# EAGLE design mkstepper17 (EAGLE 9.0.0)
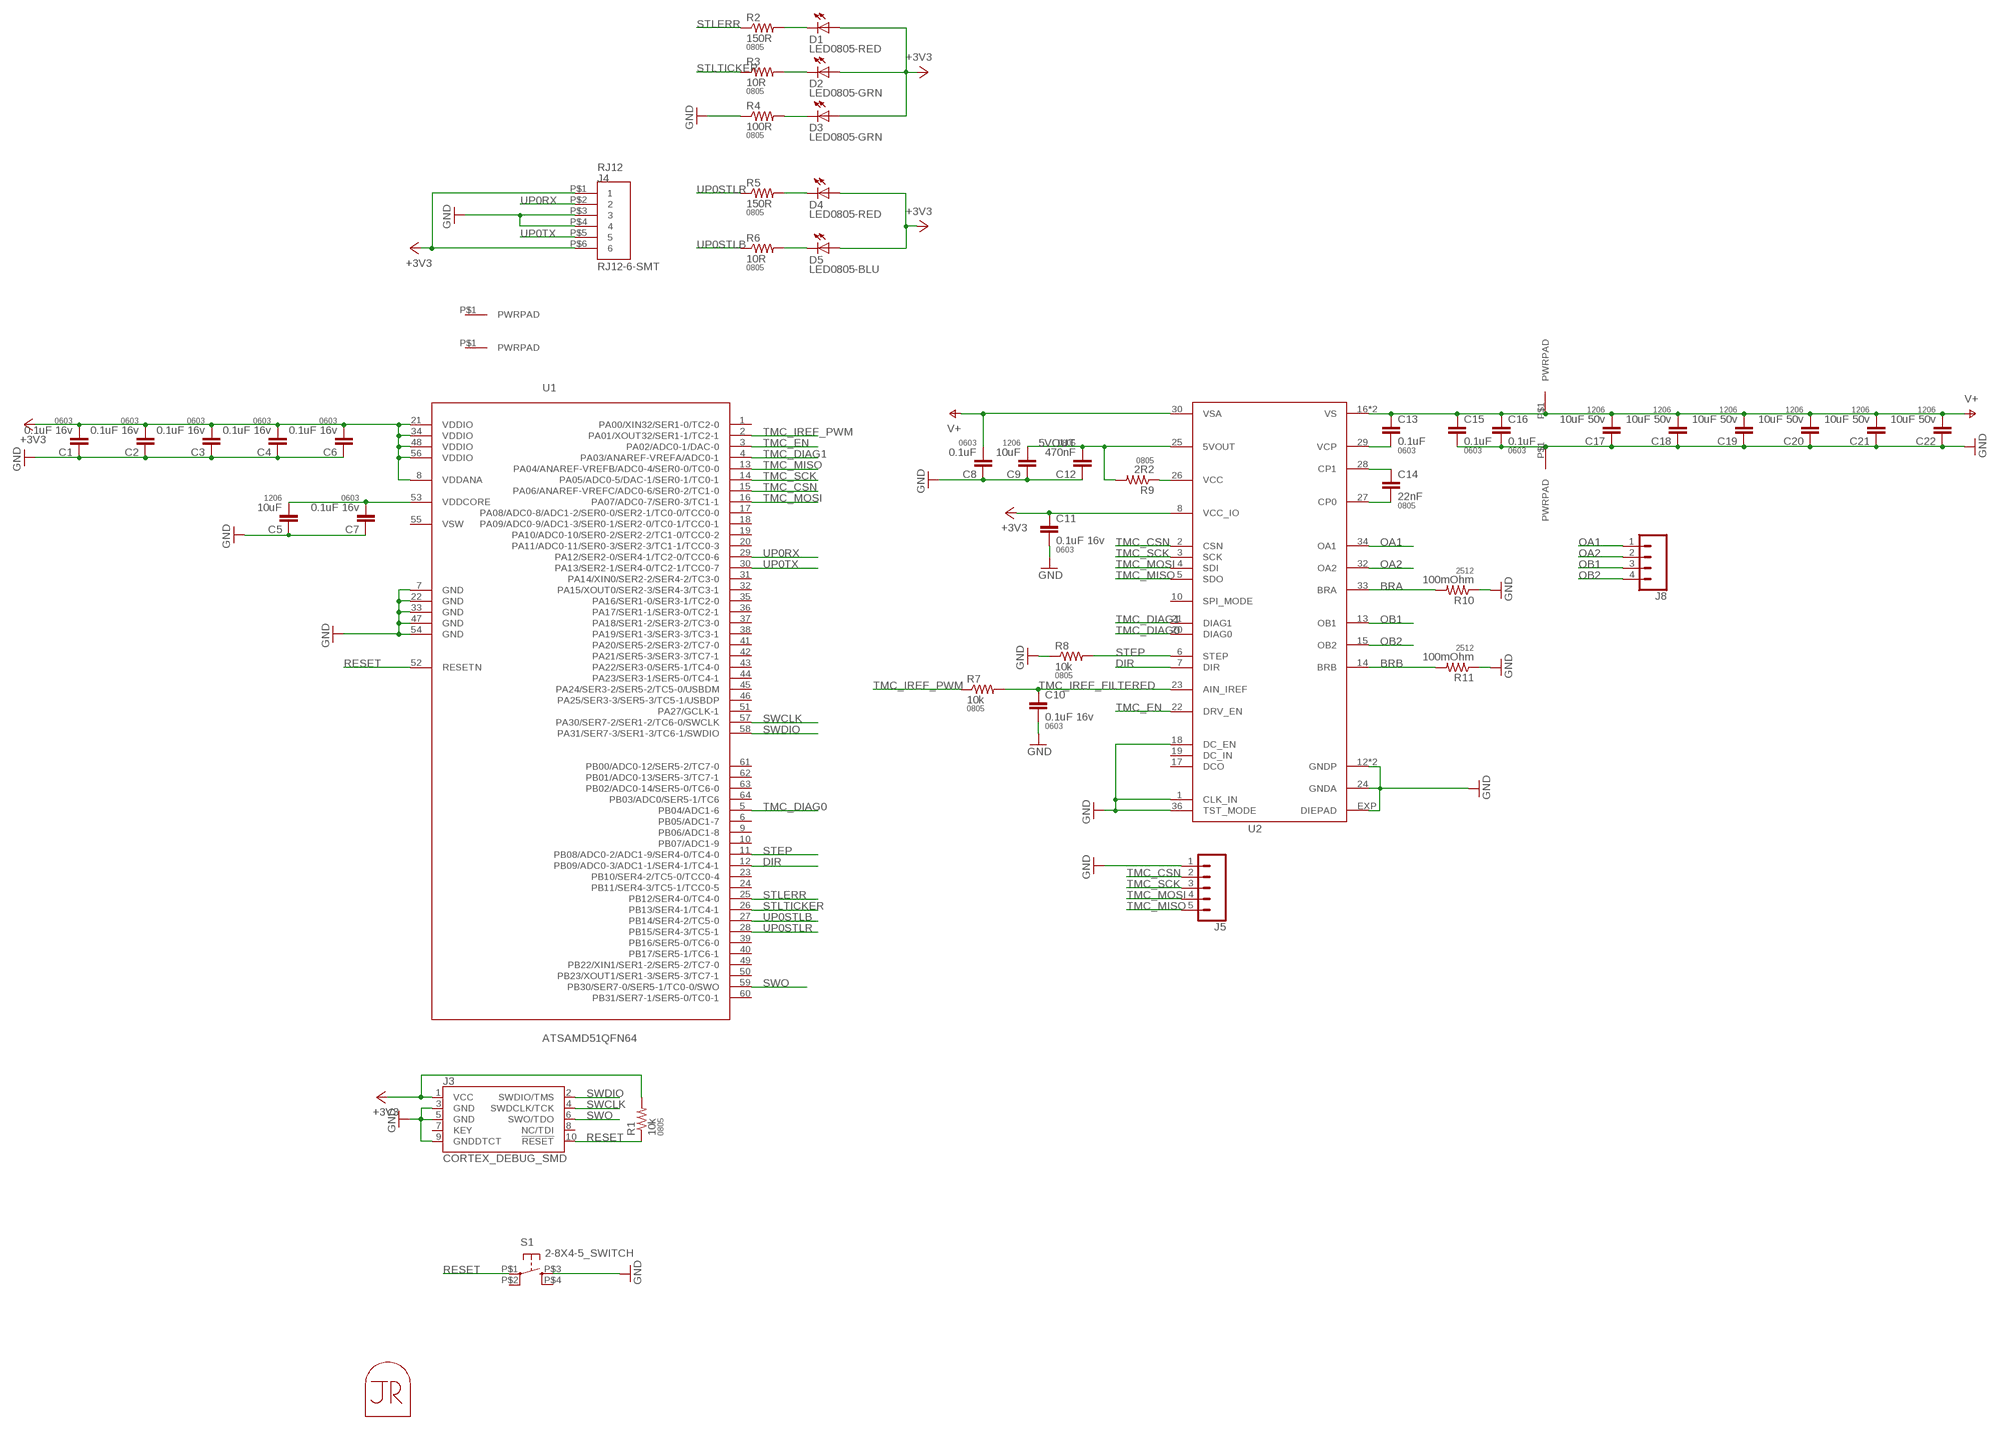
[diagram p0: schematic, sheet 1]

## Parts
C1  0.1uF 16v  CAP0603-CAP  [0603-CAP]
C2  0.1uF 16v  CAP0603-CAP  [0603-CAP]
C3  0.1uF 16v  CAP0603-CAP  [0603-CAP]
C4  0.1uF 16v  CAP0603-CAP  [0603-CAP]
C5  10uF  CAP1206  [1206]
C6  0.1uF 16v  CAP0603-CAP  [0603-CAP]
C7  0.1uF 16v  CAP0603-CAP  [0603-CAP]
C8  0.1uF  CAP0603-CAP  [0603-CAP]
C9  10uF  CAP1206  [1206]
C10  0.1uF 16v  CAP0603-CAP  [0603-CAP]
C11  0.1uF 16v  CAP0603-CAP  [0603-CAP]
C12  470nF  CAP0805  [0805]
C13  0.1uF  CAP0603-CAP  [0603-CAP]
C14  22nF  CAP0805  [0805]
C15  0.1uF  CAP0603-CAP  [0603-CAP]
C16  0.1uF  CAP0603-CAP  [0603-CAP]
C17  10uF 50v  CAP1206  [1206]
C18  10uF 50v  CAP1206  [1206]
C19  10uF 50v  CAP1206  [1206]
C20  10uF 50v  CAP1206  [1206]
C21  10uF 50v  CAP1206  [1206]
C22  10uF 50v  CAP1206  [1206]
D1  LED0805-RED  LED0805  [LED0805]
D2  LED0805-GRN  LED0805  [LED0805]
D3  LED0805-GRN  LED0805  [LED0805]
D4  LED0805-RED  LED0805  [LED0805]
D5  LED0805-BLU  LED0805  [LED0805]
J1  PWRPADM3  [PWRPAD_3-25MM]
J2  PWRPADM3  [PWRPAD_3-25MM]
J3  CORTEX_DEBUG_SMD  [SAMTECH_FTSH-105-01]
J4  RJ12-6-SMT  [RJ12-6-SMT]
J5  CONN_05NO_SILK  [1X05_NO_SILK]
J6  PWRPAD  [PWRPAD_M3-PEM-MOUNT]
J7  PWRPAD  [PWRPAD_M3-PEM-MOUNT]
J8  CONN_04LONGPADS  [1X04_LONGPADS]
MP1  JRTOMBSTONE  [JRTOMBSTONE]
R1  10k  RESISTOR0805-RES  [0805]
R2  150R  RESISTOR0805-RES  [0805]
R3  10R  RESISTOR0805-RES  [0805]
R4  100R  RESISTOR0805-RES  [0805]
R5  150R  RESISTOR0805-RES  [0805]
R6  10R  RESISTOR0805-RES  [0805]
R7  10k  RESISTOR0805-RES  [0805]
R8  10k  RESISTOR0805-RES  [0805]
R9  2R2  RESISTOR0805-RES  [0805]
R10  100mOhm  RESISTOR2512  [R2512]
R11  100mOhm  RESISTOR2512  [R2512]
S1  2-8X4-5_SWITCH  [TACT-SWITCH-KMR6]
U1  ATSAMD51QFN64  [QFN-64-9X9MM]
U2  TMC2130  [QFN36-5X6]

## Nets
5VOUT: C9.2 C12.2 R9.2 U2.25(5VOUT)
+3V3: C1.2 C2.2 C3.2 C4.2 C6.2 C11.1 D1.1(A) D2.1(A) D3.1(A) D4.1(A) D5.1(A) J3.1(VCC) J4.P$1 J4.P$6 R1.2 U1.8(VDDANA) U1.21(VDDIO) U1.34(VDDIO) U1.48(VDDIO) U1.56(VDDIO) U2.8(VCC_IO)
BRA: R10.2 U2.33(BRA)
BRB: R11.2 U2.14(BRB)
DIR: U1.12(PB09/ADC0-3/ADC1-1/SER4-1/TC4-1) U2.7(DIR)
GND: C1.1 C2.1 C3.1 C4.1 C5.1 C6.1 C7.1 C8.1 C9.1 C10.2 C11.2 C12.1 C15.2 C16.2 C17.1 C18.1 C19.1 C20.1 C21.1 C22.1 J3.3(GND) J3.5(GND) J3.9(GNDDTCT) J4.P$3 J4.P$4 J5.1 J7.P$1(PWRPAD) R4.1 R8.1 R10.1 R11.1 S1.P$3(S) U1.7(GND) U1.22(GND) U1.33(GND) U1.47(GND) U1.54(GND) U2.1(CLK_IN) U2.12(GNDP) U2.18(DC_EN) U2.24(GNDA) U2.35(GNDP) U2.36(TST_MODE) U2.EXP(DIEPAD)
N$1: D3.2(C) R4.2
N$5: D2.2(C) R3.2
N$6: D1.2(C) R2.2
N$7: C5.2 C7.2 U1.53(VDDCORE)
N$10: D4.2(C) R5.2
N$11: D5.2(C) R6.2
N$12: C14.2 U2.27(CP0)
N$13: R9.1 U2.26(VCC)
N$14: C14.1 U2.28(CP1)
N$15: C13.2 U2.29(VCP)
OA1: J8.1 U2.34(OA1)
OA2: J8.2 U2.32(OA2)
OB1: J8.3 U2.13(OB1)
OB2: J8.4 U2.15(OB2)
RESET: J3.10(!RESET) R1.1 S1.P$1(P) U1.52(RESETN)
STEP: R8.2 U1.11(PB08/ADC0-2/ADC1-9/SER4-0/TC4-0) U2.6(STEP)
STLERR: R2.1 U1.25(PB12/SER4-0/TC4-0)
STLTICKER: R3.1 U1.26(PB13/SER4-1/TC4-1)
SWCLK: J3.4(SWDCLK/TCK) U1.57(PA30/SER7-2/SER1-2/TC6-0/SWCLK)
SWDIO: J3.2(SWDIO/TMS) U1.58(PA31/SER7-3/SER1-3/TC6-1/SWDIO)
SWO: J3.6(SWO/TDO) U1.59(PB30/SER7-0/SER5-1/TC0-0/SWO)
TMC_CSN: J5.2 U1.15(PA06/ANAREF-VREFC/ADC0-6/SER0-2/TC1-0) U2.2(CSN)
TMC_DIAG0: U1.5(PB04/ADC1-6) U2.20(DIAG0)
TMC_DIAG1: U1.4(PA03/ANAREF-VREFA/ADC0-1) U2.21(DIAG1)
TMC_EN: U1.3(PA02/ADC0-1/DAC-0) U2.22(DRV_EN)
TMC_IREF_FILTERED: C10.1 R7.2 U2.23(AIN_IREF)
TMC_IREF_PWM: R7.1 U1.2(PA01/XOUT32/SER1-1/TC2-1)
TMC_MISO: J5.5 U1.13(PA04/ANAREF-VREFB/ADC0-4/SER0-0/TC0-0) U2.5(SDO)
TMC_MOSI: J5.4 U1.16(PA07/ADC0-7/SER0-3/TC1-1) U2.4(SDI)
TMC_SCK: J5.3 U1.14(PA05/ADC0-5/DAC-1/SER0-1/TC0-1) U2.3(SCK)
UP0RX: J4.P$2 U1.29(PA12/SER2-0/SER4-1/TC2-0/TCC0-6)
UP0STLB: R6.1 U1.27(PB14/SER4-2/TC5-0)
UP0STLR: R5.1 U1.28(PB15/SER4-3/TC5-1)
UP0TX: J4.P$5 U1.30(PA13/SER2-1/SER4-0/TC2-1/TCC0-7)
V+: C8.2 C13.1 C15.1 C16.1 C17.2 C18.2 C19.2 C20.2 C21.2 C22.2 J6.P$1(PWRPAD) U2.16(VS) U2.30(VSA) U2.31(VS)
Unconnected: J1.P$1(PWRPAD) J2.P$1(PWRPAD) J3.7(KEY) J3.8(NC/TDI) S1.P$2(P1) S1.P$4(S1) U1.1(PA00/XIN32/SER1-0/TC2-0) U1.6(PB05/ADC1-7) U1.9(PB06/ADC1-8) U1.10(PB07/ADC1-9) U1.17(PA08/ADC0-8/ADC1-2/SER0-0/SER2-1/TC0-0/TCC0-0) U1.18(PA09/ADC0-9/ADC1-3/SER0-1/SER2-0/TC0-1/TCC0-1) U1.19(PA10/ADC0-10/SER0-2/SER2-2/TC1-0/TCC0-2) U1.20(PA11/ADC0-11/SER0-3/SER2-3/TC1-1/TCC0-3) U1.23(PB10/SER4-2/TC5-0/TCC0-4) U1.24(PB11/SER4-3/TC5-1/TCC0-5) U1.31(PA14/XIN0/SER2-2/SER4-2/TC3-0) U1.32(PA15/XOUT0/SER2-3/SER4-3/TC3-1) U1.35(PA16/SER1-0/SER3-1/TC2-0) U1.36(PA17/SER1-1/SER3-0/TC2-1) U1.37(PA18/SER1-2/SER3-2/TC3-0) U1.38(PA19/SER1-3/SER3-3/TC3-1) U1.39(PB16/SER5-0/TC6-0) U1.40(PB17/SER5-1/TC6-1) U1.41(PA20/SER5-2/SER3-2/TC7-0) U1.42(PA21/SER5-3/SER3-3/TC7-1) U1.43(PA22/SER3-0/SER5-1/TC4-0) U1.44(PA23/SER3-1/SER5-0/TC4-1) U1.45(PA24/SER3-2/SER5-2/TC5-0/USBDM) U1.46(PA25/SER3-3/SER5-3/TC5-1/USBDP) U1.49(PB22/XIN1/SER1-2/SER5-2/TC7-0) U1.50(PB23/XOUT1/SER1-3/SER5-3/TC7-1) U1.51(PA27/GCLK-1) U1.55(VSW) U1.60(PB31/SER7-1/SER5-0/TC0-1) U1.61(PB00/ADC0-12/SER5-2/TC7-0) U1.62(PB01/ADC0-13/SER5-3/TC7-1) U1.63(PB02/ADC0-14/SER5-0/TC6-0) U1.64(PB03/ADC0/SER5-1/TC6) U2.10(SPI_MODE) U2.17(DCO) U2.19(DC_IN)

## Library data of the parts
C1-C4 C6-C8 C10 C11 C13 C15 C16 = borkedlabs-passives:CAP: Capacitor Standard 0603 ceramic capacitor, and 0.1" leaded capacitor.; PACKAGE: 0603
C5 C9 C17-C22 = borkedlabs-passives:CAP: Capacitor Standard 0603 ceramic capacitor, and 0.1" leaded capacitor.; PACKAGE: 1206
C12 C14 = borkedlabs-passives:CAP: Capacitor Standard 0603 ceramic capacitor, and 0.1" leaded capacitor.; PACKAGE: 0805
D1-D5 = lights:LED: LED
J1 J2 J6 J7 = power:PWRPAD
J3 = SparkFun-Connectors:CORTEX_DEBUG: Cortex Debug Connector - 10 pin Supports JTAG debug, Serial Wire debug, and Serial Wire Viewer. PTH and SMD connector options available. General Connector Information <http://infocenter.arm.com/help/topic/com.arm.doc.faqs/attached/13634/cortex_debug_connectors.pdf> Products: PTH Connector <http://www.digikey.com/product-detail/en/cnc-tech/3220-10-0100-00/1175-1627-ND/3883661> -via Digi-Key SparkFun PSoc <https://www.sparkfun.com/products/13229> SparkFun T <https://www.sparkfun.com/products/13810>
J4 = connector:RJ12-6-SMT
J5 = SparkFun-Connectors:CONN_05: Multi connection point. Often used as Generic Header-pin footprint for 0.1 inch spaced/style header connections On any of the 0.1 inch spaced packages, you can populate with these: Break Away Headers - Straight <https://www.sparkfun.com/products/116> (PRT-00116) Break Away Male Headers - Right Angle <https://www.sparkfun.com/products/553> (PRT-00553) Female Headers <https://www.sparkfun.com/products/115> (PRT-00115) Break Away Headers - Machine Pin <https://www.sparkfun.com/products/117> (PRT-00117) Break Away Female Headers - Swiss Machine Pin <https://www.sparkfun.com/products/743> (PRT-00743) For SCREWTERMINALS and SPRING TERMINALS visit here: Screw Terimnals on SparkFun.com <https://www.sparkfun.com/search/results?term=Screw+Terminals> (5mm/3.5mm/2.54mm spacing) This device is also useful as a general connection point to wire up your design to another part of your project. Our various solder wires solder well into these plated through hole pads. Hook-Up Wire - Assortment (Stranded, 22 AWG) <https://www.sparkfun.com/products/11375> (PRT-11375) Hook-Up Wire - Assortment (Solid Core, 22 AWG) <https://www.sparkfun.com/products/11367> (PRT-11367) View the entire wire category on our website here <https://www.sparkfun.com/categories/141> Special notes: Molex polarized connector foot print use with SKU : PRT-08231 with associated crimp pins and housings. 1MM SMD Version SKU: PRT-10208
J8 = SparkFun-Connectors:CONN_04: Multi connection point. Often used as Generic Header-pin footprint for 0.1 inch spaced/style header connections On any of the 0.1 inch spaced packages, you can populate with these: Break Away Headers - Straight <https://www.sparkfun.com/products/116> (PRT-00116) Break Away Male Headers - Right Angle <https://www.sparkfun.com/products/553> (PRT-00553) Female Headers <https://www.sparkfun.com/products/115> (PRT-00115) Break Away Headers - Machine Pin <https://www.sparkfun.com/products/117> (PRT-00117) Break Away Female Headers - Swiss Machine Pin <https://www.sparkfun.com/products/743> (PRT-00743) For SCREWTERMINALS and SPRING TERMINALS visit here: Screw Terimnals on SparkFun.com <https://www.sparkfun.com/search/results?term=Screw+Terminals> (5mm/3.5mm/2.54mm spacing) This device is also useful as a general connection point to wire up your design to another part of your project. Our various solder wires solder well into these plated through hole pads. Hook-Up Wire - Assortment (Stranded, 22 AWG) <https://www.sparkfun.com/products/11375> (PRT-11375) Hook-Up Wire - Assortment (Solid Core, 22 AWG) <https://www.sparkfun.com/products/11367> (PRT-11367) View the entire wire category on our website here <https://www.sparkfun.com/categories/141> Special notes: Molex polarized connector foot print use with SKU : PRT-08231 with associated crimp pins and housings. 1MM SMD Version SKU: PRT-10208; PROD_ID: CONN-09696
MP1 = connector:JRTOMBSTONE
R1-R9 = borkedlabs-passives:RESISTOR: Resistor Basic schematic elements and footprints for 0603, 1206, and PTH resistors.; PACKAGE: 0805
R10 R11 = borkedlabs-passives:RESISTOR: Resistor Basic schematic elements and footprints for 0603, 1206, and PTH resistors.; PACKAGE: 2512
S1 = fab:2-8X4-5_SWITCH
U1 = atsam:ATSAMD51
U2 = power:TMC2130

## Board
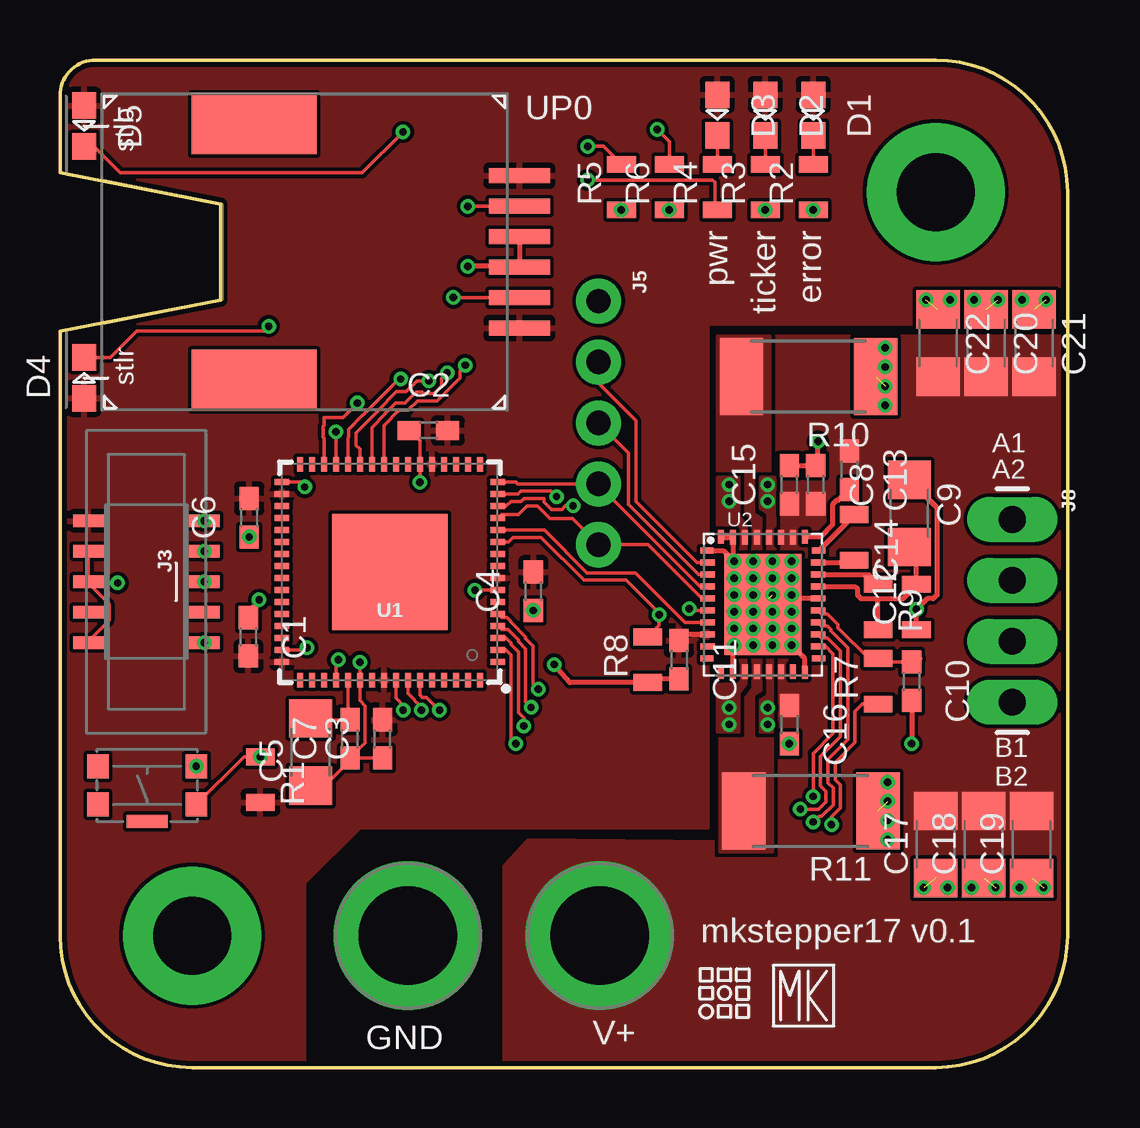
[diagram p1: board, top side]
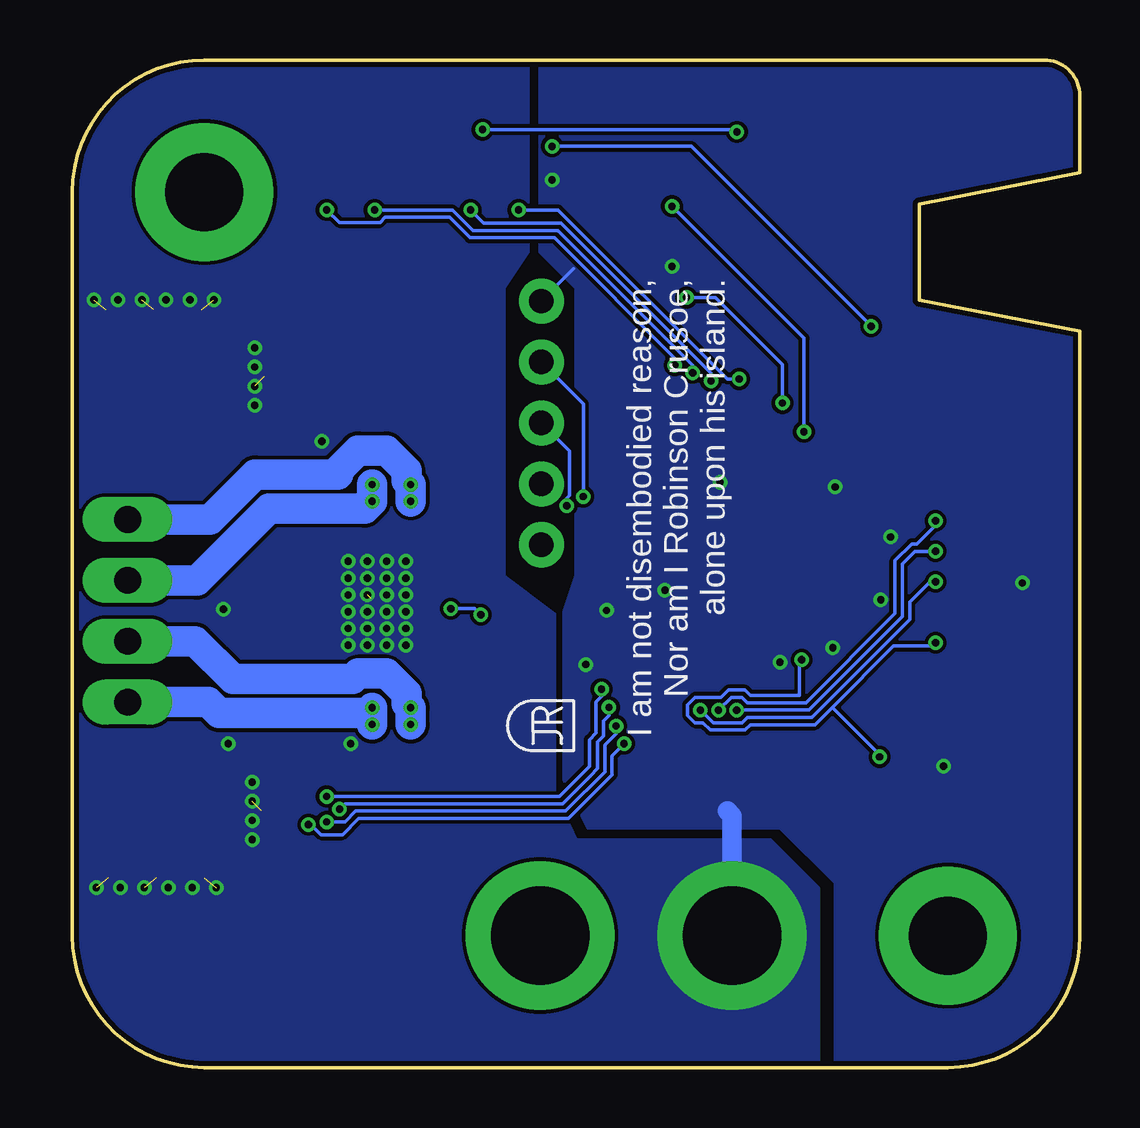
[diagram p2: board, bottom side, seen from below]

Size 42 x 42 mm. Coordinates in mm from the lower left corner, seen from the top.
Outline: 5.5,0 36.5,0 arc90 42,5.5 42,36.5 arc90 36.5,42 1.5,42 arc90 0,40.5 0,37.3 6.7,36 6.7,32 0,30.7 0,5.5 arc90 5.5,0
Copper layers (1*16): Top 0.035mm / dielectric 1.5mm / Bottom 0.035mm
Design rules "default *": minimum track width 6mil, minimum drill 0.3mm, track to track 6mil, track to pad 6mil, pad to pad 6mil, via to via 6mil, smd to smd 6mil, copper to edge 8mil, drill to drill 8mil, minimum pad ring 6mil, minimum via ring 6mil, stop-mask expansion 4mil, vias tented up to drill 27mil, thermal gap 9mil

### Footprints (pad centres in the part's own frame; a part is rotated, then mirrored left to right if it is on the bottom)
0603-CAP = smd 0.96 x 0.8: 1 -0.8,0; 2 0.8,0
1206 = smd 1.6 x 1.8: 1 -1.4,0; 2 1.4,0
0805 = smd 0.7 x 1.2: 1 -0.95,0; 2 0.95,0
LED0805 = smd 1.1 x 1: 1 -0.85,0; 2 0.85,0
PWRPAD_3-25MM = drill 3.25 pad 5.75: P$1 0,0
SAMTECH_FTSH-105-01 = smd 0.508 x 1.27: 1 -2.54,-2.413; 2 -2.54,2.413; 3 -1.27,-2.413; 4 -1.27,2.413; 5 0,-2.413; 6 0,2.413; 7 1.27,-2.413; 8 1.27,2.413; 9 2.54,-2.413; 10 2.54,2.413
RJ12-6-SMT = smd 0.635 x 2.54: P$1 -3.175,17.399; P$2 -1.905,17.399; P$3 -0.635,17.399; P$4 0.635,17.399; P$5 1.905,17.399; P$6 3.175,17.399 | smd 2.54 x 5.207: P$7 -5.334,6.35; P$8 5.334,6.35
1X05_NO_SILK = drill 1.016 pad 1.88: 1 0,0; 2 2.54,0; 3 5.08,0; 4 7.62,0; 5 10.16,0
PWRPAD_M3-PEM-MOUNT = drill 4.1 pad 6.2: P$1 0,0
1X04_LONGPADS = drill 1.118 pad 1.88 long: 1 0,0; 2 2.54,0; 3 5.08,0; 4 7.62,0
R2512 = smd 1.8 x 3.2: 1 -2.8,0; 2 2.8,0
TACT-SWITCH-KMR6 = smd 0.9 x 1: P$1 -2.05,0.8; P$2 2.05,0.8; P$3 -2.05,-0.8; P$4 2.05,-0.8 | smd 1.7 x 0.55: P$5 0,1.5
QFN-64-9X9MM = smd 0.6 x 0.25: 1 -4.5,3.75; 2 -4.5,3.25; 3 -4.5,2.75; 4 -4.5,2.25; 5 -4.5,1.75; 6 -4.5,1.25; 7 -4.5,0.75; 8 -4.5,0.25; 9 -4.5,-0.25; 10 -4.5,-0.75; 11 -4.5,-1.25; 12 -4.5,-1.75; 13 -4.5,-2.25; 14 -4.5,-2.75; 15 -4.5,-3.25; 16 -4.5,-3.75; 33 4.5,-3.75; 34 4.5,-3.25; 35 4.5,-2.75; 36 4.5,-2.25; 37 4.5,-1.75; 38 4.5,-1.25; 39 4.5,-0.75; 40 4.5,-0.25; 41 4.5,0.25; 42 4.5,0.75; 43 4.5,1.25; 44 4.5,1.75; 45 4.5,2.25; 46 4.5,2.75; 47 4.5,3.25; 48 4.5,3.75 | smd 0.25 x 0.6: 17 -3.75,-4.5; 18 -3.25,-4.5; 19 -2.75,-4.5; 20 -2.25,-4.5; 21 -1.75,-4.5; 22 -1.25,-4.5; 23 -0.75,-4.5; 24 -0.25,-4.5; 25 0.25,-4.5; 26 0.75,-4.5; 27 1.25,-4.5; 28 1.75,-4.5; 29 2.25,-4.5; 30 2.75,-4.5; 31 3.25,-4.5; 32 3.75,-4.5; 49 3.75,4.5; 50 3.25,4.5; 51 2.75,4.5; 52 2.25,4.5; 53 1.75,4.5; 54 1.25,4.5; 55 0.75,4.5; 56 0.25,4.5; 57 -0.25,4.5; 58 -0.75,4.5; 59 -1.25,4.5; 60 -1.75,4.5; 61 -2.25,4.5; 62 -2.75,4.5; 63 -3.25,4.5; 64 -3.75,4.5 | smd 4.826 x 4.826: P$1 0,0
QFN36-5X6 = smd 0.55 x 0.25: 1 -2.325,1.75; 10 -2.325,-2.75; 19 2.325,-2.75; 28 2.325,1.75 | smd 0.6 x 0.25: 2 -2.3,1.25; 3 -2.3,0.75; 4 -2.3,0.25; 5 -2.3,-0.25; 6 -2.3,-0.75; 7 -2.3,-1.25; 8 -2.3,-1.75; 9 -2.3,-2.25; 20 2.3,-2.25; 21 2.3,-1.75; 22 2.3,-1.25; 23 2.3,-0.75; 24 2.3,-0.25; 25 2.3,0.25; 26 2.3,0.75; 27 2.3,1.25 | smd 0.25 x 0.55: 11 -1.75,-3.325; 18 1.75,-3.325; 29 1.75,2.325; 36 -1.75,2.325 | smd 0.25 x 0.6: 12 -1.25,-3.3; 13 -0.75,-3.3; 14 -0.25,-3.3; 15 0.25,-3.3; 16 0.75,-3.3; 17 1.25,-3.3; 30 1.25,2.3; 31 0.75,2.3; 32 0.25,2.3; 33 -0.25,2.3; 34 -0.75,2.3; 35 -1.25,2.3 | smd 3.2 x 4.2: EXP 0,-0.5

### Placement (x,y rotation side)
C1  7.85,17.95 270 top
C2  15.36,26.55 0 top
C3  13.45,13.7 90 top
C4  19.73,19.85 90 top
C5  10.45,13.15 90 top
C6  7.89,22.92 90 top
C7  12.1,13.7 90 top
C8  31.5,24.3 270 top
C9  35.4,23.1 270 top
C10  35.5,16.1 270 top
C11  25.8,17 270 top
C12  35.7,19.2 90 top
C13  32.9,24.9 270 top
C14  33.1,22.1 270 top
C15  30.4,24.3 90 top
C16  30.4,14.3 270 top
C17  36.5,9.3 90 top
C18  38.5,9.3 90 top
C19  40.5,9.3 90 top
C20  38.6,30.2 270 top
C21  40.6,30.2 270 top
C22  36.6,30.2 270 top
D1  31.4,39.7 270 top
D2  29.4,39.7 270 top
D3  27.4,39.7 270 top
D4  1,28.75 90 top
D5  1,39.25 270 top
J1  36.5,36.5 0 top
J2  5.5,5.5 0 top
J3  3.6,20.25 270 top
J4  1.75,34 270 top
J5  22.45,31.95 270 top
J6  22.5,5.5 0 top
J7  14.5,5.5 0 top
J8  39.7,22.85 270 top
MP1  22.1,14.3 90 bottom
R1  8.35,12 270 top
R2  31.4,36.7 90 top
R3  29.4,36.7 90 top
R4  27.4,36.7 90 top
R5  23.4,36.7 90 top
R6  25.4,36.7 90 top
R7  34.1,16.1 90 top
R8  24.5,17 90 top
R9  34.1,19.2 270 top
R10  31.2,28.8 180 top
R11  31.3,10.7 180 top
S1  3.63,11.76 180 top
U1  13.75,20.65 180 top
U2  29.3,19.8 0 top
U$5  [CBA-SILK-LOGO]  27.7,3.1 90 top
U$9  [MK-LOGO-SILK]  31,3 0 top

### Tracks (layer width: path | path; a pad name or v marks a point on that pad's centre or on a via)
5VOUT
  Top 0.203: C12.2 35.8,20.35 | C12.2 35.7,20.1 35.15,19.55 34.1,19.55 | C12.2 35.7,21.4 C9.2 | U2.25 33.15,20.05 33.25,19.95 33.25,19.7 33.4,19.55 34.1,19.55 | R9.2 34.1,19.55
+3V3
  Top 0.203: U2.8 26.05,18.05 C11.1
  pour Top: 45,31 27,31 27,10 12.5,10 10.2,7.7 10.2,-1 -1,-1 -1,44 45,44
BRA
  pour Top (rank 4, no thermals): 27.4,21.4 27.4,30.5 29.6,30.5 29.6,21.4
BRB
  pour Top (rank 4, no thermals): 27.5,9 27.5,18.1 29.7,18.1 29.7,9
DIR
  Top 0.152: U1.12 20.19,22.4 21.97,20.62 23.98,20.62 26.05,18.55 U2.7
GND  (via drill 0.3)  (9 unrouted)
  Top 0.152: 28.05,21.05 v28.1,21.1 | 28.05,18.05 U2.EXP | U1.7 v17.3,19.9 | v15,24.4 U1.22 15,26.11 C2.1 | U1.33 10,24.4 v10.2,24.2 | U1.47 10.2,17.4 v10.3,17.5 | v12.5,16.9 U1.54 12.5,15.3 12.73,15.07 12.73,13.53 12.15,12.95 | 12.15,12.95 C7.1 | C3.1 12.2,12.9 | 12.2,12.9 12.15,12.95 | C5.1 11.05,11.75 12.2,12.9 | C1.1 7.85,19.05 v8.3,19.5 | J3.3 J3.5 | J3.5 1.19,20.19 2.05,19.33 2.05,18.63 1.19,17.77 J3.9 | J3.5 1.24,20.2 v2.4,20.2 | R4.1 27.3,35.85 27.3,36.9 27.2,37 v22,37
  Top 0.203: U2.24 29.55,19.55 U2.EXP | C9.1 36.55,23.35 36.55,19.7 36.41,19.55 36.15,19.55 v35.7,19.1 C12.1 | C10.2 v35.5,13.5 | C15.2 C8.1 31.6,25.2 v31.6,26.1 | C11.2 24.65,16.2 R8.1 21.25,16.05 v20.6,16.8 | J4.P$3 J4.P$4 19.11,33.4 v17,33.4 | U2.12 28.05,17.55 v28.1,17.6 | 28.05,21.15 U2.35 27.57,22.1 U2.36 | 28.05,21.15 v28.1,21.1 | U2.1 27.65,21.55 28.05,21.15 | U2.18 31.05,17.05 v30.5,17.6
  Bottom 0.152: J5.1 21.1,33.3
  Bottom 0.813: J7.P$1 14.5,10.5 14.7,10.7
  other vias: 30.5,20.4 29.7,20.4 28.9,20.4 28.1,20.4 28.9,18.3 28.9,19 28.1,18.3 28.1,19 29.7,19 29.7,18.3 30.5,18.3 30.5,19 28.1,19.7 28.9,19.7 29.7,19.7 30.5,19.7 30.4,13.5 19.73,19.05 7.89,22.12 5.68,12.56 28.9,17.6 29.7,17.6 30.5,21.1 29.7,21.1 28.9,21.1 34.4,30 34.4,29.2 34.4,27.6 34.4,28.4 36.1,32 37.1,32 38.1,32 39.1,32 40.1,32 41.1,32 36,7.5 37,7.5 38,7.5 39,7.5 40,7.5 41,7.5 34.5,9.5 34.5,11.9 34.5,10.3 34.5,11.1
  pour Bottom: 23,43.5 23,34 24,32.5 24,20.5 21.9,18.9 21.9,11.4 21,9.5 12.9,9.5 10.9,7.5 10.9,-2.5 44.5,-2.5 44.5,43.5
  pour Bottom: 22.5,44.5 22.5,34 21,32.5 21,20.5 21.5,19 21.5,12 20.5,10 12.5,10 10.2,7.7 10.2,-1 -1.5,-1 -1.5,44.5
N$1
  Top 0.152: D3.2 R4.2
N$5
  Top 0.152: D2.2 R3.2
N$6
  Top 0.152: D1.2 R2.2
N$7
  Top 0.152: U1.53 12,14.7 C7.2 10.7,14.5 C5.2
N$10  (via drill 0.3)
  Top 0.152: R5.2 22.65,38.4 v22,38.4 | v8.7,30.9 8.5,30.7 3.2,30.7 2.1,29.6 D4.2
  Bottom 0.152: v22,38.4 16.2,38.4 v8.7,30.9
N$11  (via drill 0.3)
  Top 0.152: D5.2 1.4,38.4 2.5,37.3 12.6,37.3 v14.3,39 | v24.9,39.1 25.4,38.6 R6.2
  Bottom 0.152: v14.3,39 14.4,39.1 v24.9,39.1
N$12
  Top 0.203: U2.27 32.7,21.05 C14.2
N$13
  Top 0.203: R9.1 33.7,20.55 33.51,20.55 32.09,20.55 U2.26
N$14
  Top 0.203: U2.28 32.8,22.73 C14.1
N$15
  Top 0.203: C13.2 32.45,23.65 32.4,23.65 32.2,23.46 32.2,22.63 31.7,22.12 U2.29
OA1  (via drill 0.3)
  Bottom 1.27: J8.1 36.26,22.85 34.39,24.72 30.92,24.72 30.92,24.89 30.09,25.72 28.91,25.72 28.08,24.89 28.08,24.48 v27.9,24.3 v27.9,23.6
  pour Top (no thermals): 28.3,21.4 28.3,22.6 27.4,22.6 27.4,24.6 28.3,24.6 28.3,23 28.6,22.6 28.6,21.4
OA2  (via drill 0.3)
  Bottom 1.27: v29.5,24.3 v29.5,23.6 29.8,23.3 33.8,23.3 36.8,20.3 39.49,20.3 J8.2
  pour Top (no thermals): 29.5,21.4 29.5,23.1 29.2,23.3 29.2,24.6 29.8,24.6 29.8,21.4
OB1  (via drill 0.3)
  Bottom 1.27: v27.9,14.3 v27.9,15 28.08,15.18 28.08,15.59 28.91,16.42 30.09,16.42 30.31,16.2 35.3,16.2 36.87,17.77 J8.3
  pour Top (no thermals): 28.3,17.2 28.3,16 27.4,16 27.4,14 28.3,14 28.3,15.6 28.6,16 28.6,17.2
OB2  (via drill 0.3)
  Bottom 1.27: v29.5,14.3 v29.5,15 29.72,14.78 35.89,14.78 36.34,15.23 J8.4
  pour Top (no thermals): 29.5,17.2 29.5,15.5 29.2,15.3 29.2,14 29.7,14 29.7,17.2
RESET  (via drill 0.3)
  Top 0.152: U1.52 11.5,16.9 v11.6,17 | S1.P$1 7.67,12.95 R1.1
  Bottom 0.152: v11.6,17 11.7,16.9 11.7,15.51 13.73,15.51 13.96,15.74 14.66,15.74 14.96,15.43 16.04,15.43 16.35,15.12 16.35,14.68 16.04,14.37 15.71,14.37 15.41,14.06 13.96,14.06 13.73,14.29 11.05,14.29 10.32,15.02 | 10.32,15.02 7.77,17.57 6.15,17.57 J3.10 | R1.1 8.35,13.05 10.32,15.02
  other vias: 6.01,17.71 8.35,12.95
STEP  (via drill 0.3)
  Top 0.152: U2.6 26.3,19.05 v26.23,19.13 | R8.2 24.98,18.43 v24.98,18.88 24.98,18.94 23.6,20.32 21.84,20.32 20.06,22.09 18.89,22.09 18.7,21.9 U1.11
  Bottom 0.152: v26.23,19.13 25.23,19.13 v24.98,18.88
STLERR  (via drill 0.3)
  Top 0.152: v16.89,29.28 16.67,29.06 16.67,28.74 15.72,27.79 14.9,27.79 14.51,27.4 14.14,27.4 13.5,26.76 U1.25
  Bottom 0.152: R2.1 30.87,35.22 29.18,35.22 28.95,35.45 26.28,35.45 25.42,34.59 21.9,34.59 16.81,29.5 16.79,29.5 16.65,29.35 16.82,29.35 v16.89,29.28
  other vias: 31.4,35.75
STLTICKER  (via drill 0.3)
  Top 0.152: v16.14,28.96 15.91,28.72 15.91,28.41 15.59,28.09 15.16,28.09 15.09,28.16 14.84,28.16 14.39,27.7 14,27.7 13.54,27.25 13.54,27.23 13,26.69 U1.26
  Bottom 0.152: v16.14,28.96 16.14,29.28 21.76,34.9 25.3,34.9 26.15,35.75 R3.1
  other vias: 29.4,35.75
SWCLK  (via drill 0.3)
  Top 0.152: U1.57 14,15.4 14.3,15.09 v14.3,14.9
  Bottom 0.152: v14.3,14.9 11.3,14.9 7.4,18.8 7.4,21 6.88,21.52 J3.4
  other vias: 6.01,21.52
SWDIO  (via drill 0.3)
  Top 0.152: U1.58 14.5,15.6 15.06,15.04 v15.06,14.9
  Bottom 0.152: v15.06,14.9 14.53,15.43 14.09,15.43 13.86,15.2 11.43,15.2 7.71,18.93 7.71,21.13 7.01,21.82 6.8,21.82 6.01,22.61 J3.2
  other vias: 6.01,22.79
SWO  (via drill 0.3)
  Top 0.152: U1.59 15,15.53 15.1,15.43 15.28,15.43 15.59,15.12 15.59,14.94 15.63,14.9 v15.82,14.9
  Bottom 0.152: v15.82,14.9 v15.81,14.9 15.28,14.37 14.09,14.37 13.86,14.59 11.17,14.59 7.1,18.67 7.1,19.4 6.24,20.25 J3.6
  other vias: 6.01,20.25
TMC_CSN  (via drill 0.3)
  Top 0.152: U2.2 26.54,21.05 24,23.59 24,26.97 22.45,28.52 J5.2 | U1.15 19.1,23.9 19.23,24.02 20.47,24.02 v20.7,23.8
  Bottom 0.152: v20.7,23.8 20.7,27.66 J5.2
TMC_DIAG0  (via drill 0.3)
  Top 0.152: U2.20 31.92,17.55 32.23,17.25 32.23,13.93 31.4,13.1 v31.4,11.3 | v19.94,15.77 19.71,16 19.71,17.58 19.41,17.88 19.41,17.95 18.78,18.58 18.78,18.62 18.64,18.75 18.4,18.75 U1.5
  Bottom 0.152: v31.4,11.3 21.7,11.3 20.45,12.55 20.45,13.66 20.17,13.94 20.17,15.23 19.94,15.46 v19.94,15.77
TMC_DIAG1  (via drill 0.3)
  Top 0.152: U2.21 31.75,17.9 32,17.9 32.53,17.37 32.53,13.8 31.7,12.97 31.7,11.75 31.93,11.52 31.93,11.08 31.62,10.77 v30.86,10.77 | U1.4 18.4,18.25 18.68,18.25 19.11,17.83 19.11,17.76 19.41,17.45 19.41,15.24 v19.64,15.02
  Bottom 0.152: v30.86,10.77 30.63,10.99 21.57,10.99 20.28,12.28 20.23,12.33 20.11,12.46 20.11,13.57 19.87,13.82 19.87,14.45 19.64,14.69 v19.64,15.02
TMC_EN  (via drill 0.3)
  Top 0.152: U2.22 31.75,18.4 31.99,18.4 32.13,18.27 32.13,18.2 32.84,17.5 32.84,13.67 32.01,12.85 32.01,11.87 32.24,11.65 32.24,10.95 31.75,10.46 31.63,10.46 v31.4,10.24 | v19.34,14.23 19.34,14.57 19.11,14.8 19.11,17.33 18.8,17.63 18.8,17.7 18.6,17.9 U1.3
  Bottom 0.152: v31.4,10.24 30.64,10.24 30.19,10.69 21.45,10.69 19.8,12.33 19.8,13.45 19.34,13.92 v19.34,14.23
TMC_IREF_FILTERED
  Top 0.152: U2.23 31.75,18.9 31.99,18.9 32.43,18.46 32.43,18.33 33.71,17.05 R7.2 34.25,16.9 C10.1
  Top 0.203: 35.85,17.05 C10.1
TMC_IREF_PWM  (via drill 0.3)
  Top 0.152: R7.1 33.45,15.15 33.14,14.84 33.14,13.55 32.31,12.72 32.31,12 32.54,11.77 32.54,10.83 32.16,10.44 v32.16,10.12 | U1.2 18.6,17.4 18.8,17.2 18.8,13.7 v19,13.5
  Bottom 0.152: v32.16,10.12 32.04,10.12 31.62,9.71 30.74,9.71 30.06,10.39 21.32,10.39 19.5,12.21 19.5,13 v19,13.5
TMC_MISO
  Top 0.152: U2.5 26.75,19.55 24.5,21.8 J5.5 | J5.5 | U1.13 18.4,23.05 19.11,23.05 19.48,23.42 19.9,23.42 20.43,22.89 21.37,22.89 J5.5
TMC_MOSI
  Top 0.152: U2.4 26.68,20.05 22.45,24.28 J5.4 19.07,24.33 19,24.4 U1.16
TMC_SCK  (via drill 0.3)
  Top 0.152: U2.3 26.61,20.55 23.7,23.46 23.7,25.62 J5.3 | U1.14 18.6,23.4 18.8,23.59 19.23,23.59 19.35,23.72 20.17,23.72 20.17,23.58 20.48,23.27 20.92,23.27 21.07,23.42 v21.39,23.42
  Bottom 0.152: v21.39,23.42 21.39,23.74 21.28,23.85 21.28,25.7 J5.3
UP0RX  (via drill 0.3)
  Top 0.152: v17,35.9 v17,35.91 J4.P$2 | U1.29 v11.5,26.5
  Bottom 0.152: v11.5,26.5 11.5,30.4 v17,35.9
UP0STLB  (via drill 0.3)
  Top 0.152: v15.38,28.62 14.88,28.62 14.42,28.17 14.03,28.17 13.24,27.37 13.24,27.35 12.34,26.45 12.34,25.94 12.5,25.77 U1.27
  Bottom 0.152: R6.1 24.85,35.2 21.63,35.2 15.38,28.94 v15.38,28.62
  other vias: 25.4,35.75
UP0STLR  (via drill 0.3)
  Top 0.152: U1.28 12,26.25 12.03,26.28 12.03,26.6 12.6,27.17 12.62,27.17 12.93,27.48 12.93,27.5 14.13,28.7 v14.2,28.7
  Bottom 0.152: v14.2,28.7 14.7,28.7 21.75,35.75 R5.1
  other vias: 23.4,35.75
UP0TX  (via drill 0.3)
  Top 0.152: J4.P$5 v16.41,32.09 v16.4,32.1 | v12.4,27.7 11.8,27.1 11,27.1 11,26.75 10.97,26.72 10.97,26.28 11,26.25 U1.30
  Bottom 0.152: v16.4,32.1 15.2,32.1 12.4,29.3 v12.4,27.7
V+
  pour Top (rank 5, no thermals): 44.5,30.5 27.5,30.5 27.6,9.4 19.5,9.5 18.5,8.4 18.5,-0.6 19.6,-1 44.5,-1

### Text on the board
tPlace: UP0 | pwr | ticker | error | A1 | A2 | B1 | B2 | mkstepper17 v0.1 | GND | V+
bPlace: I am not disembodied reason, / Nor am I Robinson Crusoe, / alone upon his island.